# EAGLE design chv (EAGLE 7.6.0)
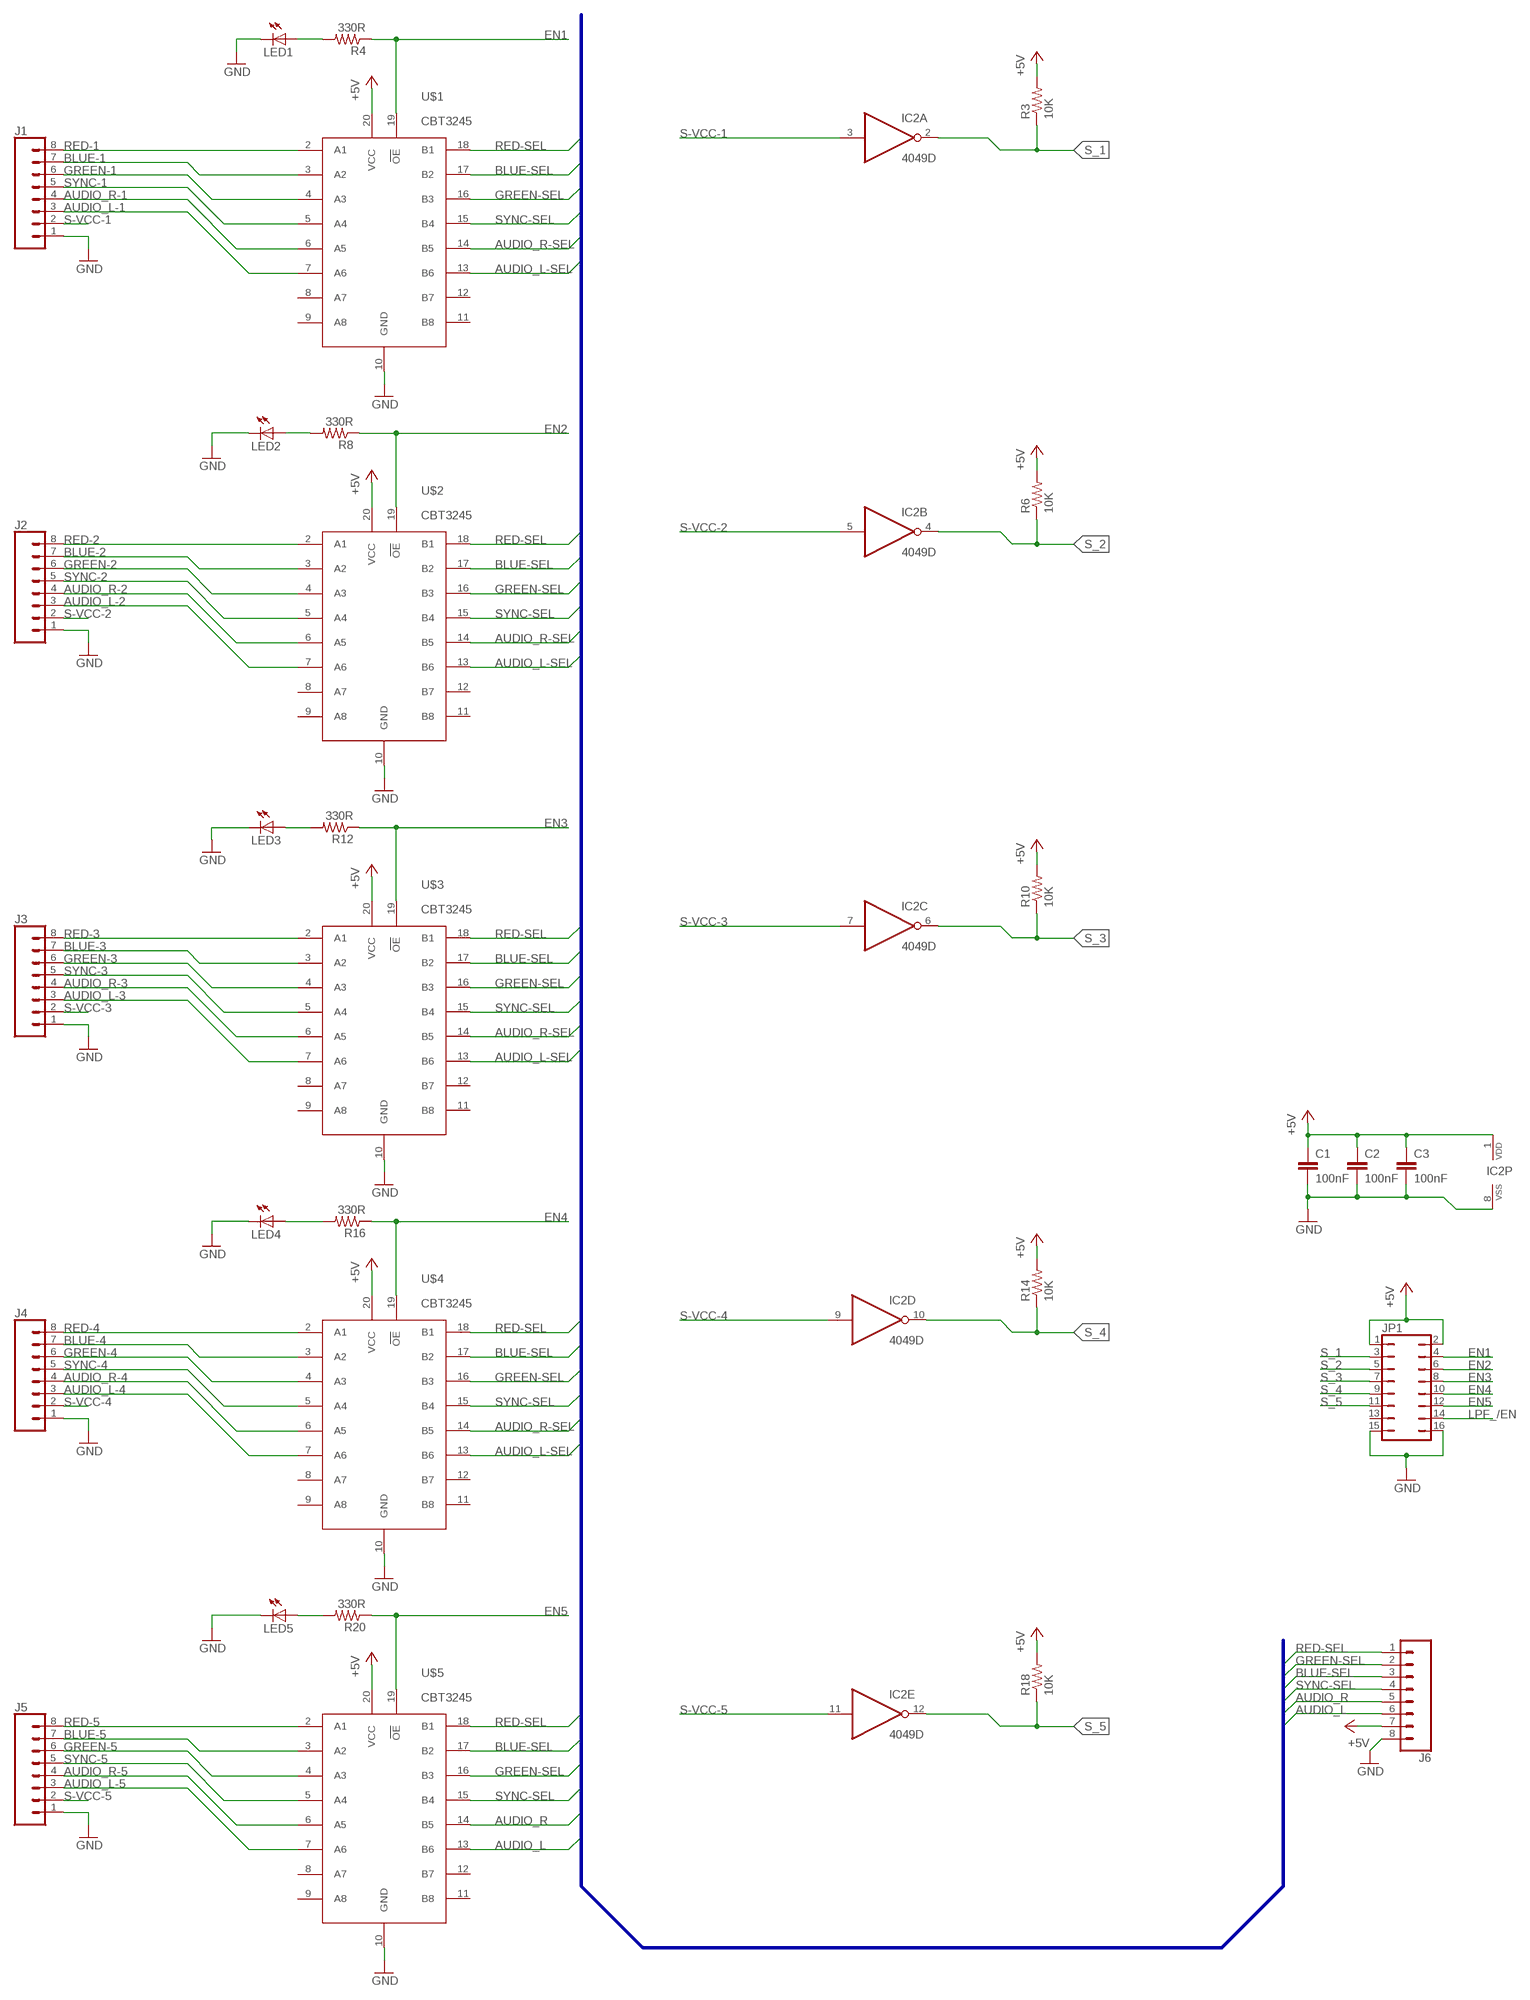
[diagram p0: schematic, sheet 1]

## Parts
C1  100nF  C-EU075-032X103  [C075-032X103]
C2  100nF  C-EU075-032X103  [C075-032X103]
C3  100nF  C-EU075-032X103  [C075-032X103]
IC2  4049D  [SO16]
J1  CONN_08LONGPADS  [1X08_LONGPADS]
J2  CONN_08LONGPADS  [1X08_LONGPADS]
J3  CONN_08LONGPADS  [1X08_LONGPADS]
J4  CONN_08LONGPADS  [1X08_LONGPADS]
J5  CONN_08LONGPADS  [1X08_LONGPADS]
J6  CONN_08LONGPADS  [1X08_LONGPADS]
JP1  JP8Q  [JP8Q]
LED1  LED5MM  [LED5MM]
LED2  LED5MM  [LED5MM]
LED3  LED5MM  [LED5MM]
LED4  LED5MM  [LED5MM]
LED5  LED5MM  [LED5MM]
R3  10K  R-US_0204/2V  [0204V]
R4  330R  R-US_0204/2V  [0204V]
R6  10K  R-US_0204/2V  [0204V]
R8  330R  R-US_0204/2V  [0204V]
R10  10K  R-US_0204/2V  [0204V]
R12  330R  R-US_0204/2V  [0204V]
R14  10K  R-US_0204/2V  [0204V]
R16  330R  R-US_0204/2V  [0204V]
R18  10K  R-US_0204/2V  [0204V]
R20  330R  R-US_0204/2V  [0204V]
U$1  CBT3245  [SO20]
U$2  CBT3245  [SO20]
U$3  CBT3245  [SO20]
U$4  CBT3245  [SO20]
U$5  CBT3245  [SO20]

## Nets
+5V: C1.1 C2.1 C3.1 IC2.1(P:VDD) J6.7 JP1.1 JP1.2 R3.2 R6.2 R10.2 R14.2 R18.2 U$1.20(VCC) U$2.20(VCC) U$3.20(VCC) U$4.20(VCC) U$5.20(VCC)
AUDIO_L: J6.6 U$5.13(B6)
AUDIO_L-1: J1.3 U$1.7(A6)
AUDIO_L-2: J2.3 U$2.7(A6)
AUDIO_L-3: J3.3 U$3.7(A6)
AUDIO_L-4: J4.3 U$4.7(A6)
AUDIO_L-5: J5.3 U$5.7(A6)
AUDIO_L-SEL: U$1.13(B6) U$2.13(B6) U$3.13(B6) U$4.13(B6)
AUDIO_R: J6.5 U$5.14(B5)
AUDIO_R-1: J1.4 U$1.6(A5)
AUDIO_R-2: J2.4 U$2.6(A5)
AUDIO_R-3: J3.4 U$3.6(A5)
AUDIO_R-4: J4.4 U$4.6(A5)
AUDIO_R-5: J5.4 U$5.6(A5)
AUDIO_R-SEL: U$1.14(B5) U$2.14(B5) U$3.14(B5) U$4.14(B5)
BLUE-1: J1.7 U$1.3(A2)
BLUE-2: J2.7 U$2.3(A2)
BLUE-3: J3.7 U$3.3(A2)
BLUE-4: J4.7 U$4.3(A2)
BLUE-5: J5.7 U$5.3(A2)
BLUE-SEL: J6.3 U$1.17(B2) U$2.17(B2) U$3.17(B2) U$4.17(B2) U$5.17(B2)
EN1: JP1.4 R4.1 U$1.19(OE)
EN2: JP1.6 R8.1 U$2.19(OE)
EN3: JP1.8 R12.1 U$3.19(OE)
EN4: JP1.10 R16.1 U$4.19(OE)
EN5: JP1.12 R20.1 U$5.19(OE)
GND: C1.2 C2.2 C3.2 IC2.8(P:VSS) J1.1 J2.1 J3.1 J4.1 J5.1 J6.8 JP1.15 JP1.16 LED1.K(C) LED2.K(C) LED3.K(C) LED4.K(C) LED5.K(C) U$1.10(GND) U$2.10(GND) U$3.10(GND) U$4.10(GND) U$5.10(GND)
GREEN-1: J1.6 U$1.4(A3)
GREEN-2: J2.6 U$2.4(A3)
GREEN-3: J3.6 U$3.4(A3)
GREEN-4: J4.6 U$4.4(A3)
GREEN-5: J5.6 U$5.4(A3)
GREEN-SEL: J6.2 U$1.16(B3) U$2.16(B3) U$3.16(B3) U$4.16(B3) U$5.16(B3)
LPF_/EN: JP1.14
N$1: LED1.A R4.2
N$2: LED2.A R8.2
N$5: LED3.A R12.2
N$6: LED4.A R16.2
N$7: LED5.A R20.2
RED-1: J1.8 U$1.2(A1)
RED-2: J2.8 U$2.2(A1)
RED-3: J3.8 U$3.2(A1)
RED-4: J4.8 U$4.2(A1)
RED-5: J5.8 U$5.2(A1)
RED-SEL: J6.1 U$1.18(B1) U$2.18(B1) U$3.18(B1) U$4.18(B1) U$5.18(B1)
S-VCC-1: IC2.3(A:I) J1.2
S-VCC-2: IC2.5(B:I) J2.2
S-VCC-3: IC2.7(C:I) J3.2
S-VCC-4: IC2.9(D:I) J4.2
S-VCC-5: IC2.11(E:I) J5.2
S_1: IC2.2(A:O) JP1.3 R3.1
S_2: IC2.4(B:O) JP1.5 R6.1
S_3: IC2.6(C:O) JP1.7 R10.1
S_4: IC2.10(D:O) JP1.9 R14.1
S_5: IC2.12(E:O) JP1.11 R18.1
SYNC-1: J1.5 U$1.5(A4)
SYNC-2: J2.5 U$2.5(A4)
SYNC-3: J3.5 U$3.5(A4)
SYNC-4: J4.5 U$4.5(A4)
SYNC-5: J5.5 U$5.5(A4)
SYNC-SEL: J6.4 U$1.15(B4) U$2.15(B4) U$3.15(B4) U$4.15(B4) U$5.15(B4)
Unconnected: IC2.14(F:I) IC2.15(F:O) JP1.13 U$1.8(A7) U$1.9(A8) U$1.11(B8) U$1.12(B7) U$2.8(A7) U$2.9(A8) U$2.11(B8) U$2.12(B7) U$3.8(A7) U$3.9(A8) U$3.11(B8) U$3.12(B7) U$4.8(A7) U$4.9(A8) U$4.11(B8) U$4.12(B7) U$5.8(A7) U$5.9(A8) U$5.11(B8) U$5.12(B7)

## Buses
B$1

## Library data of the parts
C1-C3 = rcl:C-EU: CAPACITOR, European symbol
IC2 = 40xx:4049: Hex inverting BUFFER
J1-J6 = SparkFun-Connectors:CONN_08: Multi connection point. Often used as Generic Header-pin footprint for 0.1 inch spaced/style header connections On any of the 0.1 inch spaced packages, you can populate with these: Break Away Headers - Straight <https://www.sparkfun.com/products/116> (PRT-00116) Break Away Male Headers - Right Angle <https://www.sparkfun.com/products/553> (PRT-00553) Female Headers <https://www.sparkfun.com/products/115> (PRT-00115) Break Away Headers - Machine Pin <https://www.sparkfun.com/products/117> (PRT-00117) Break Away Female Headers - Swiss Machine Pin <https://www.sparkfun.com/products/743> (PRT-00743) Arduino Stackable Header - 8 Pin <https://www.sparkfun.com/products/9279> (PRT-09279) For SCREWTERMINALS and SPRING TERMINALS visit here: Screw Terimnals on SparkFun.com <https://www.sparkfun.com/search/results?term=Screw+Terminals> (5mm/3.5mm/2.54mm spacing) This device is also useful as a general connection point to wire up your design to another part of your project. Our various solder wires solder well into these plated through hole pads. Hook-Up Wire - Assortment (Stranded, 22 AWG) <https://www.sparkfun.com/products/11375> (PRT-11375) Hook-Up Wire - Assortment (Solid Core, 22 AWG) <https://www.sparkfun.com/products/11367> (PRT-11367) View the entire wire category on our website here <https://www.sparkfun.com/categories/141> Special notes: Molex polarized connector foot print use with SKU : PRT-08231 with associated crimp pins and housings. 1MM SMD Version SKU: PRT-10208 NOTES ON THE VARIANTS LOCK and LOCK_LONGPADS... This footprint was designed to help hold the alignment of a through-hole component (i.e. 6-pin header) while soldering it into place. You may notice that each hole has been shifted either up or down by 0.005 of an inch from it's more standard position (which is a perfectly straight line). This slight alteration caused the pins (the squares in the middle) to touch the edges of the holes. Because they are alternating, it causes a "brace" to hold the component in place. 0.005 has proven to be the perfect amount of "off-center" position when using our standard breakaway headers. Although looks a little odd when you look at the bare footprint, once you have a header in there, the alteration is very hard to notice. Also,if you push a header all the way into place, it is covered up entirely on the bottom side.
JP1 = jumper:JP8Q: JUMPER
LED1-LED5 = led:LED: LED OSRAM: - CHIPLED LG R971, LG N971, LY N971, LG Q971, LY Q971, LO R971, LY R971 LH N974, LH R974 LS Q976, LO Q976, LY Q976 LO Q996 - Hyper CHIPLED LW Q18S LB Q993, LB Q99A, LB R99A - SideLED LS A670, LO A670, LY A670, LG A670, LP A670 LB A673, LV A673, LT A673, LW A673 LH A674 LY A675 LS A676, LA A676, LO A676, LY A676, LW A676 LS A679, LY A679, LG A679 - Hyper Micro SIDELED® LS Y876, LA Y876, LO Y876, LY Y876 LT Y87S - SmartLED LW L88C, LW L88S LB L89C, LB L89S, LG L890 LS L89K, LO L89K, LY L89K LS L896, LA L896, LO L896, LY L896 - TOPLED LS T670, LO T670, LY T670, LG T670, LP T670 LSG T670, LSP T670, LSY T670, LOP T670, LYG T670 LG T671, LOG T671, LSG T671 LB T673, LV T673, LT T673, LW T673 LH T674 LS T676, LA T676, LO T676, LY T676, LB T676, LH T676, LSB T676, LW T676 LB T67C, LV T67C, LT T67C, LS T67K, LO T67K, LY T67K, LW E67C LS E67B, LA E67B, LO E67B, LY E67B, LB E67C, LV E67C, LT E67C LW T67C LS T679, LY T679, LG T679 LS T770, LO T770, LY T770, LG T770, LP T770 LB T773, LV T773, LT T773, LW T773 LH T774 LS E675, LA E675, LY E675, LS T675 LS T776, LA T776, LO T776, LY T776, LB T776 LHGB T686 LT T68C, LB T68C - Hyper Mini TOPLED® LB M676 - Mini TOPLED Santana® LG M470 LS M47K, LO M47K, LY M47K Source: http://www.osram.convergy.de LUXEON: - LUMILED® LXK2-PW12-R00, LXK2-PW12-S00, LXK2-PW14-U00, LXK2-PW14-V00 LXK2-PM12-R00, LXK2-PM12-S00, LXK2-PM14-U00 LXK2-PE12-Q00, LXK2-PE12-R00, LXK2-PE12-S00, LXK2-PE14-T00, LXK2-PE14-U00 LXK2-PB12-K00, LXK2-PB12-L00, LXK2-PB12-M00, LXK2-PB14-N00, LXK2-PB14-P00, LXK2-PB14-Q00 LXK2-PR12-L00, LXK2-PR12-M00, LXK2-PR14-Q00, LXK2-PR14-R00 LXK2-PD12-Q00, LXK2-PD12-R00, LXK2-PD12-S00 LXK2-PH12-R00, LXK2-PH12-S00 LXK2-PL12-P00, LXK2-PL12-Q00, LXK2-PL12-R00 Source: www.luxeon.com KINGBRIGHT: KA-3528ASYC Source: www.kingbright.com
R3 R4 R6 R8 R10 R12 R14 R16 R18 R20 = rcl:R-US_: RESISTOR, American symbol
U$1-U$5 = CBT3245:CBT3245

## Net classes
0 default: width 0.406 mm
1 AMP: width 0.381 mm
2 POWER: width 0.5 mm

## Board
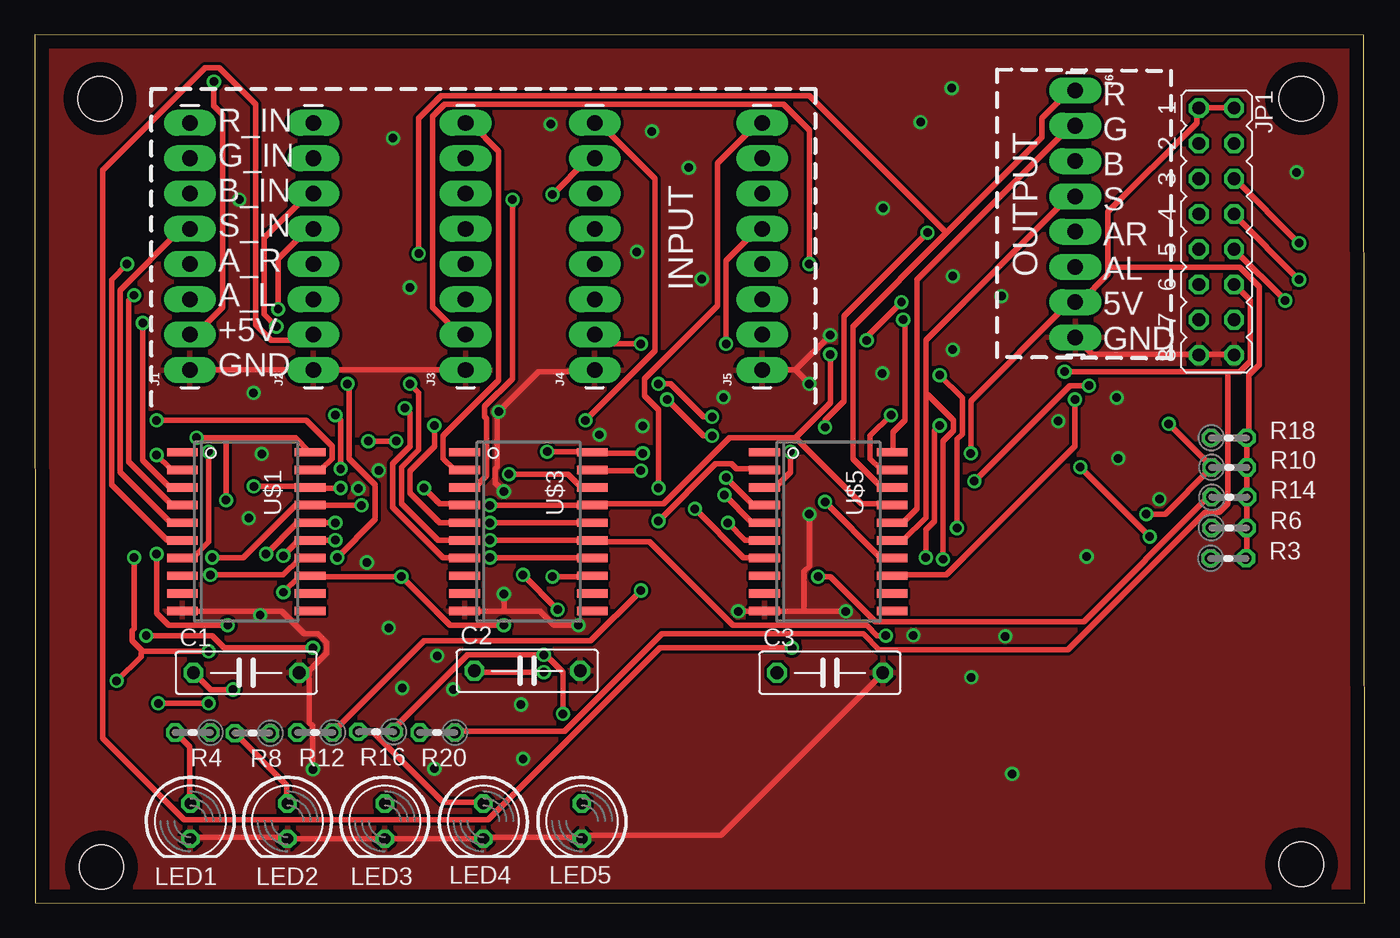
[diagram p1: board, top side]
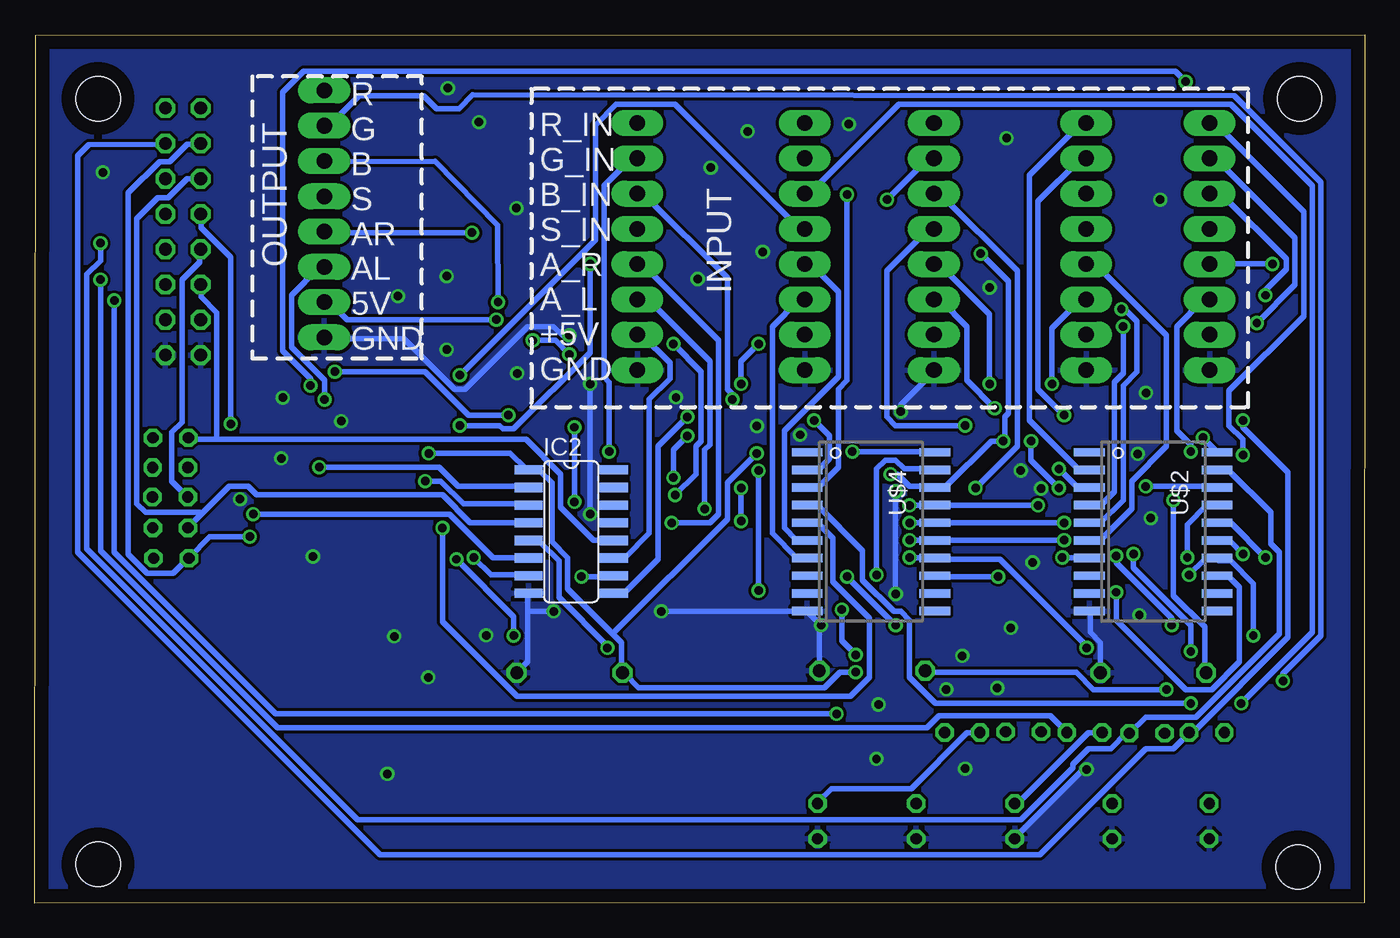
[diagram p2: board, bottom side, seen from below]

Size 95.76 x 62.5 mm. Coordinates in mm from the lower left corner, seen from the top.
Outline: 0.04,0.03 95.76,0 95.69,62.48 0,62.5 0.04,0.03
Copper layers (1*16): Top 0.035mm / dielectric 1.5mm / Bottom 0.035mm
Design rules "default": minimum track width 10mil, minimum drill 24mil, track to track 8mil, track to pad 8mil, pad to pad 8mil, via to via 8mil, smd to smd 8mil, copper to edge 40mil, drill to drill 8mil, minimum pad ring 10mil, minimum via ring 8mil, stop-mask expansion 4mil, vias tented up to drill 0mil, thermal gap 10mil
Holes 3.2 mm at 4.7,57.9 4.8,2.6 91.2,2.8 91.2,57.9

### Footprints (pad centres in the part's own frame; a part is rotated, then mirrored left to right if it is on the bottom)
C075-032X103 = drill 0.914 octagon: 1 -3.81,0; 2 3.81,0
SO16 = smd 0.66 x 2.032: 1 -4.445,-3.073; 2 -3.175,-3.073; 3 -1.905,-3.073; 4 -0.635,-3.073; 5 0.635,-3.073; 6 1.905,-3.073; 7 3.175,-3.073; 8 4.445,-3.073; 9 4.445,3.073; 10 3.175,3.073; 11 1.905,3.073; 12 0.635,3.073; 13 -0.635,3.073; 14 -1.905,3.073; 15 -3.175,3.073; 16 -4.445,3.073
1X08_LONGPADS = drill 1.118 pad 1.88 long: 1 0,0; 2 2.54,0; 3 5.08,0; 4 7.62,0; 5 10.16,0; 6 12.7,0; 7 15.24,0; 8 17.78,0
JP8Q = drill 0.914 octagon: 1 -8.89,-1.27; 2 -8.89,1.27; 3 -6.35,-1.27; 4 -6.35,1.27; 5 -3.81,-1.27; 6 -3.81,1.27; 7 -1.27,-1.27; 8 -1.27,1.27; 9 1.27,-1.27; 10 1.27,1.27; 11 3.81,-1.27; 12 3.81,1.27; 13 6.35,-1.27; 14 6.35,1.27; 15 8.89,-1.27; 16 8.89,1.27
LED5MM = drill 0.813 octagon: A -1.27,0; K 1.27,0
0204V = drill 0.813 octagon: 1 -1.27,0; 2 1.27,0
SO20 = smd 0.6 x 2.2: 1 -5.715,-4.6; 2 -4.445,-4.6; 3 -3.175,-4.6; 4 -1.905,-4.6; 5 -0.635,-4.6; 6 0.635,-4.6; 7 1.905,-4.6; 8 3.175,-4.6; 9 4.445,-4.6; 10 5.715,-4.6; 11 5.715,4.6; 12 4.445,4.6; 13 3.175,4.6; 14 1.905,4.6; 15 0.635,4.6; 16 -0.635,4.6; 17 -1.905,4.6; 18 -3.175,4.6; 19 -4.445,4.6; 20 -5.715,4.6

### Placement (x,y rotation side)
C1  15.23,16.58 0 top
C2  35.46,16.72 0 top
C3  57.25,16.58 0 top
IC2  57.14,26.74 270 bottom
J1  11.17,38.37 90 top
J2  20.06,38.37 90 top
J3  31.02,38.37 90 top
J4  40.31,38.37 90 top
J5  52.37,38.37 90 top
J6  74.92,58.49 270 top
JP1  85.08,48.33 270 top
LED1  11.2,5.9 270 top
LED2  18.2,5.9 270 top
LED3  25.2,5.9 270 top
LED4  32.3,5.9 270 top
LED5  39.4,5.9 270 top
R3  85.93,24.82 0 top
R4  11.38,12.28 180 top
R6  85.99,27.01 0 top
R8  15.68,12.23 180 top
R10  86,31.36 0 top
R12  20.18,12.28 180 top
R14  86.01,29.22 0 top
R16  24.58,12.33 180 top
R18  85.97,33.49 0 top
R20  28.98,12.28 180 top
U$1  15.23,26.74 270 top
U$2  15.23,26.74 270 bottom
U$3  35.55,26.74 270 top
U$4  35.55,26.74 270 bottom
U$5  57.14,26.74 270 top

### Tracks (layer width: path | path; a pad name or v marks a point on that pad's centre or on a via)
+5V  (via drill 0.61)
  Top 0.406: R3.2 87.28,24.88 87.28,27 R6.2 87.28,27.12 87.28,29.12 R14.2 87.28,29.25 87.28,31.25 R10.2 87.28,31.38 87.28,33.38 R18.2 87.4,33.62 87.4,38 88.15,38.75 88.15,44.38 86.78,45.75 77.28,45.75 | JP1.2 86.28,57.25 83.9,57.25 JP1.1 83.65,57.12 83.65,56.12 77.28,49.75 77.28,45.75 | v62.52,42 62.65,41.88 62.65,34.75 61.77,33.88 61.77,32.5 U$5.20 | 77.28,45.75 77.28,45.25 75.28,43.25 J6.7 74.78,43.12 74.4,43.12 67.4,36.12 v67.4,32.38 | 13.78,33.5 18.77,33.5 19.77,32.5 U$1.20 | 13.78,33.5 v11.65,33.5 | 13.78,33.5 v13.78,29 | v14.28,15.38 12.65,15.38 11.53,16.5 C1.1 | v36.9,32.5 40.15,32.5 U$3.20 40.27,32.38 v43.77,32.38 | v36.65,16.62 31.65,16.62 C2.1
  Bottom 0.406: v62.52,42 73.28,42 74.53,43.25 J6.7 | v11.65,33.5 10.65,32.5 U$2.20 | v13.78,29 13.78,22.12 11.53,19.88 11.53,16.62 C1.1 | v14.28,15.38 19.52,15.38 20.77,16.62 31.65,16.62 C2.1 | v36.9,32.5 31.02,32.5 U$4.20 | 54.15,19.38 53.52,18.75 53.52,16.62 C3.1 53.27,16.5 52.27,15.5 38.9,15.5 37.77,16.62 v36.65,16.62 | 54.15,19.38 57.4,22.62 57.4,24.88 58.52,26 58.52,30.25 59.4,31.12 60.15,31.12 IC2.1 60.4,31.25 61.52,32.38 v67.4,32.38 | v43.77,32.38 45.9,30.25 45.9,27.62 54.15,19.38
AUDIO_L  (via drill 0.61)
  Top 0.406: v74.9,36.25 74.9,32.88 65.65,23.62 61.77,23.62 U$5.13
  Bottom 0.406: v74.9,36.25 74.9,37.62 77.28,40 77.28,43.75 75.28,45.75 75.03,45.75 J6.6
AUDIO_L-1  (via drill 0.61)
  Top 0.406: v12.53,32.5 12.53,26 11.4,24.88 10.65,24.88 U$1.7
  Bottom 0.406: v12.53,32.5 12.53,33 13.53,34 13.53,41.5 11.65,43.38 11.28,43.38 J1.3
AUDIO_L-2  (via drill 0.61)
  Top 0.406: v21.77,24.88 24.52,27.62 24.51,30.09 22.64,31.97 22.65,37.25 v22.52,37.38
  Bottom 0.406: v21.77,24.88 19.9,24.88 U$2.7 | v22.52,37.38 22.52,41.38 20.52,43.38 20.15,43.38 J2.3
AUDIO_L-3  (via drill 0.61)
  Top 0.406: v26.65,35.62 27.02,35.25 27.02,32.88 25.77,31.62 25.77,28.5 29.4,24.88 30.9,24.88 U$3.7
  Bottom 0.406: v26.65,35.62 28.65,37.62 28.65,41.5 30.52,43.38 30.9,43.38 J3.3
AUDIO_L-4
  Bottom 0.406: U$4.7 40.15,24.88 40.9,24.88 42.65,26.62 42.65,41.5 40.77,43.38 40.4,43.38 J4.3
AUDIO_L-5  (via drill 0.61)
  Top 0.406: v47.52,28.38 51.02,24.88 52.52,24.88 U$5.7
  Bottom 0.406: v47.52,28.38 47.52,32.62 47.15,33 47.15,39 51.52,43.38 52.27,43.38 J5.3
AUDIO_L-SEL  (via drill 0.61)
  Top 0.406: v17.9,22.38 19.02,23.5 19.77,23.5 U$1.13 20.02,23.5 v26.4,23.5 29.9,20 v33.77,20 | v37.27,23.5 40.15,23.5 U$3.13
  Bottom 0.406: v17.9,22.38 17.9,20.38 12.9,15.38 11.03,15.38 9.03,17.38 9.03,22.75 9.78,23.5 10.53,23.5 U$2.13 | v26.4,23.5 30.9,23.5 U$4.13 | v33.77,20 v37.27,23.5
AUDIO_R  (via drill 0.61)
  Top 0.406: v56.9,28.88 60.9,24.88 61.65,24.88 U$5.14 | v56.9,34.25 56.9,34.75 58.27,36.12 58.27,42.25 v64.28,48.25
  Bottom 0.406: v56.9,34.25 v56.9,28.88 | v64.28,48.25 74.9,48.25 J6.5
AUDIO_R-1  (via drill 0.61)
  Top 0.406: v6.65,46 5.53,44.88 5.53,30.12 9.53,26.12 10.53,26.12 U$1.6
  Bottom 0.406: v6.65,46 11.15,46 J1.4
AUDIO_R-2
  Bottom 0.406: U$2.6 19.77,26.12 19.02,26.12 16.77,28.38 16.77,30.38 14.28,32.88 14.28,40.88 19.27,45.88 20.02,45.88 J2.4
AUDIO_R-3  (via drill 0.61)
  Top 0.406: v27.02,37.38 27.65,36.75 27.65,32.62 26.4,31.38 26.4,28.75 29.02,26.12 30.9,26.12 U$3.6
  Bottom 0.406: v27.02,37.38 27.02,42.38 30.52,45.88 30.9,45.88 J3.4
AUDIO_R-4
  Bottom 0.406: U$4.6 40.15,26.12 40.9,26.12 41.77,27 41.77,34 37.9,37.88 37.9,44 39.77,45.88 40.27,45.88 J4.4
AUDIO_R-5  (via drill 0.61)
  Top 0.406: v49.9,27.38 51.15,26.12 52.52,26.12 U$5.6
  Bottom 0.406: v49.9,27.38 47.15,27.38 46.52,28 46.52,40.5 51.9,45.88 52.27,45.88 J5.4
AUDIO_R-SEL  (via drill 0.61)
  Top 0.406: v32.77,24.88 40.15,24.88 U$3.14 | v12.65,23.62 17.9,23.62 19.02,24.75 19.77,24.75 U$1.14 | v20.02,18.38 13.65,18.38 12.78,19.25 v8.03,19.25
  Bottom 0.406: v32.77,24.88 31.02,24.88 U$4.14 30.77,24.75 26.27,24.75 20.02,18.5 v20.02,18.38 | v12.65,23.62 11.53,24.75 10.65,24.75 U$2.14 10.53,24.62 9.65,24.62 8.03,23 v8.03,19.25
BLUE-1  (via drill 0.61)
  Top 0.406: v7.78,41.75 7.78,31.88 9.65,30 10.53,30 U$1.3
  Bottom 0.406: v7.78,41.75 5.03,44.5 5.03,47.88 10.65,53.5 11.15,53.5 J1.7
BLUE-2  (via drill 0.61)
  Top 0.406: v22.02,31.25 22.02,34.75 v21.65,35.12
  Bottom 0.406: v22.02,31.25 20.77,30 19.9,30 U$2.3 | v21.65,35.12 23.52,37 23.52,50.5 20.52,53.5 20.15,53.5 J2.7
BLUE-3  (via drill 0.61)
  Top 0.406: v34.4,50.62 34.4,37.75 32.4,35.75 32.4,35 32.52,34.88 32.52,30.75 31.77,30 31.02,30 U$3.3
  Bottom 0.406: v34.4,50.62 31.52,53.5 31.02,53.5 J3.7
BLUE-4  (via drill 0.61)
  Top 0.406: v37.27,51 39.77,53.5 40.27,53.5 J4.7
  Bottom 0.406: v37.27,51 37.27,37.62 37.9,37 37.9,31.38 39.27,30 40.15,30 U$4.3
BLUE-5  (via drill 0.61)
  Top 0.406: v54.4,32.5 54.4,31 53.4,30 52.65,30 U$5.3
  Bottom 0.406: v54.4,32.5 54.4,37.5 54.77,37.88 54.77,51.62 52.9,53.5 52.4,53.5 J5.7
BLUE-SEL  (via drill 0.61)
  Top 0.406: v12.78,24.88 15.03,24.88 18.77,28.62 19.77,28.62 U$1.17 20.02,28.62 v23.52,28.62 | v32.77,28.62 40.15,28.62 U$3.17 40.27,28.75 45.27,28.75 50.02,33.5 54.77,33.5 | 54.77,33.5 59.52,28.75 61.65,28.75 U$5.17 | v62.4,43.25 59.9,40.75 v59.9,40.5 | v57.27,39.5 57.27,36 54.77,33.5
  Bottom 0.406: v12.78,24.88 12.78,27.25 11.4,28.62 10.65,28.62 U$2.17 | v32.77,28.62 31.02,28.62 U$4.17 30.77,28.62 v23.52,28.62 | v62.4,43.25 62.42,48.79 66.95,53.38 74.9,53.38 J6.3 | v59.9,40.5 58.27,40.5 v57.27,39.5
EN1  (via drill 0.61)
  Top 0.406: v8.78,34.75 19.52,34.75 21.4,32.88 21.4,32 20.65,31.25 19.9,31.25 U$1.19
  Bottom 0.406: v8.78,34.75 8.78,34.25 5.53,31 5.53,19.12 12.28,12.38 12.65,12.38 R4.1 12.78,12.12 13.78,11.12 15.78,11.12 23.4,3.5 70.9,3.5 92.65,25.25 92.68,53.63 92.68,53.79 91.87,54.6 86.4,54.62 JP1.4
EN2  (via drill 0.61)
  Top 0.406: v91.03,47.5 86.4,52.12 JP1.6
  Bottom 0.406: U$2.19 10.53,31.12 9.78,31.12 6.78,28.12 6.78,25.88 6.15,25.25 6.15,19.38 12.15,13.38 15.78,13.38 16.9,12.25 R8.1 17.15,12.25 18.27,11.12 19.9,11.12 21.02,10 21.02,9.75 24.77,6 72.53,6 92.03,25.5 92.03,45.25 91.03,46.25 v91.03,47.5
EN3  (via drill 0.61)
  Top 0.406: v43.65,31.12 40.15,31.12 U$3.19 | v43.65,22.5 40.02,18.88 28.02,18.88 21.52,12.38 R12.1 | v91.03,44.88 86.4,49.5 JP1.8
  Bottom 0.406: v43.65,22.5 v43.65,31.12 | v91.03,44.88 91.03,25.38 78.28,12.62 31.52,12.62 30.65,13.5 22.65,13.5 21.52,12.38 R12.1
EN4  (via drill 0.61)
  Top 0.406: v37.65,21.12 v35.15,23.62 | R16.1 25.9,12.38 25.9,12.62 31.15,17.88 v36.65,17.88 36.77,17.88 38.02,16.62 v38.02,13.62 | v90.03,43.38 86.4,47 JP1.10
  Bottom 0.406: v35.15,23.62 35.15,31.25 34.52,31.88 33.77,31.88 33.15,31.25 31.02,31.25 U$4.19 | v37.65,21.12 37.65,18.88 v36.65,17.88 | v90.03,43.38 90.03,25.25 78.4,13.62 v38.02,13.62
EN5  (via drill 0.61)
  Top 0.406: v61.65,35.12 60.15,33.62 60.15,32 60.9,31.25 61.65,31.25 U$5.19 | 85.9,38.25 86.78,38.25 87.53,39 87.53,43.38 86.4,44.5 JP1.12 | 85.9,38.25 v74.15,38.25 | 85.9,38.25 85.9,28.75 85.28,28.12 84.28,28.12 74.4,18.25 60.77,18.25 59.65,19.38 45.15,19.38 38.15,12.38 30.27,12.38 R20.1
  Bottom 0.406: v61.65,35.12 64.53,35.12 67.65,38.25 v74.15,38.25
GND  (via drill 0.61)
  Top 0.406: 19.65,16.62 21.02,18 21.02,18.75 20.4,19.38 19.4,19.38 17.77,21 10.65,21 U$1.10 | 19.65,16.62 19.15,16.62 C1.2 | LED1.K 11.28,4.75 18.15,4.75 LED2.K 18.4,4.62 25.15,4.62 LED3.K 25.4,4.62 32.27,4.62 LED4.K 32.4,4.75 39.4,4.75 LED5.K 39.52,4.88 49.4,4.88 61.02,16.5 C3.2 | v20.02,9.62 20.02,12.75 19.77,13 19.77,16.5 19.65,16.62 | JP1.16 86.28,39.5 83.9,39.5 JP1.15 83.65,39.5 76.15,39.5 75.03,40.62 J6.8 | 54.77,38.38 52.4,38.38 J5.1 | v57.27,40.88 54.77,38.38 | J1.1 11.28,38.38 20.02,38.38 J2.1 20.15,38.38 30.9,38.38 J3.1 | J4.1 40.27,38.25 36.27,38.25 v33.4,35.38 33.27,35.25 33.27,31.38 33.15,31.25 33.15,30.25 v33.77,29.62 | 33.77,21 36.4,21 37.4,20 v39.15,20 | 33.77,21 31.02,21 U$3.10 | v58.4,21 55.4,21 | 55.4,21 52.65,21 U$5.10 52.4,21 v50.65,21 | 33.77,21 v33.77,22.25 | v55.77,37.38 54.77,38.38 | v55.77,28 55.77,24.25 55.4,23.88 55.4,21
  Bottom 0.406: U$2.10 19.77,21 19.77,19.5 19.02,18.75 19.02,16.62 C1.2 | v20.02,9.62 20.27,9.62 25.15,4.75 LED3.K | v57.27,40.88 57.77,40.88 58.4,41.5 60.27,41.5 64.78,37 65.53,37 69.15,40.62 74.9,40.62 J6.8 | v33.4,35.38 33.4,35.88 31.02,38.25 J3.1 | C2.2 39.27,16.75 39.27,19.88 v39.15,20 40.15,21 U$4.10 40.27,21 v50.65,21 | 60.27,21 60.27,17.38 61.02,16.62 C3.2 | 60.27,21 60.27,22.25 IC2.8 | 60.27,21 v58.4,21 | v33.77,22.25 v33.77,29.62 | v55.77,28 v55.77,37.38
  other vias: 37.15,56.07 14.73,50.63 16.23,20.73 26.46,15.48 30.13,15.39 28.98,17.8 35.16,10.39 28.77,9.68 35.01,14.3 23.91,24.52 25.48,19.81 15.76,36.73 16.35,32.34 15.41,27.71 24.77,31.14 23.3,29.84 25.79,55.06 44.44,55.54 47.09,52.93 48.02,44.92 43.35,46.87 66.1,45.12 69.6,43.69 66.1,39.83 61.02,38.13 66.02,58.66 63.77,56.21 61.07,50.02 90.86,52.59 70.37,9.3 75.73,24.95 77.9,36.38 78.01,32.01 63.26,19.27 69.88,19.2 67.43,16.25 73.69,34.69 80.97,29.08 49.59,36.4 43.77,34.34 40.66,33.71 27.01,44.31
  pour Top: -0.07,62.56 95.64,62.56 95.69,-0.06 -0.02,-0.06
  pour Bottom: -0.05,62.55 95.64,62.55 95.64,-0.12 -0.05,-0.12
GREEN-1  (via drill 0.61)
  Top 0.406: v7.15,43.75 6.78,43.38 6.78,31.75 9.78,28.75 10.53,28.75 U$1.4
  Bottom 0.406: v7.15,43.75 7.15,44.12 5.65,45.62 5.65,46.38 10.28,51 11.15,51 J1.6
GREEN-2  (via drill 0.61)
  Top 0.406: v17.4,41.5 16.52,42.38 16.52,47.88 19.65,51 20.02,51 J2.6
  Bottom 0.406: v17.4,41.5 17.4,38.12 18.02,37.5 18.02,29.62 18.9,28.75 19.77,28.75 U$2.4
GREEN-3  (via drill 0.61)
  Top 0.406: v28.02,29.88 29.15,28.75 30.9,28.75 U$3.4
  Bottom 0.406: v28.02,29.88 25.02,32.88 25.02,45.5 30.52,51 30.9,51 J3.6
GREEN-4  (via drill 0.61)
  Top 0.406: v8.9,14.38 v12.53,14.38
  Bottom 0.406: v12.53,14.38 30.9,14.38 32.77,16.25 32.77,20.38 33.4,21 33.9,21 36.15,23.25 36.15,25.38 39.4,28.62 40.15,28.62 U$4.4 | v8.9,14.38 3.77,19.5 3.77,51.62 9.65,57.5 33.52,57.5 39.9,51.12 40.27,51.12 J4.6
GREEN-5  (via drill 0.61)
  Top 0.406: v49.77,30.62 51.65,28.75 52.52,28.75 U$5.4 | v48.77,33.62 48.15,33.62 v45.52,36.25
  Bottom 0.406: v49.77,30.62 49.77,32.62 v48.77,33.62 | v45.52,36.25 45.52,36.62 45.9,37 45.9,45 51.9,51 52.27,51 J5.6
GREEN-SEL  (via drill 0.61)
  Top 0.406: U$3.16 v32.77,27.38 | v7.15,24.88 7.15,19.75 7.03,19.62 7.03,18.88 7.78,18.12 | v12.53,18.12 7.78,18.12 | v16.65,25.12 18.9,27.38 U$1.16 v21.65,27.38 | U$5.16 62.52,27.38 63.52,28.38 63.52,44.88 74.53,55.88 74.9,55.88 J6.2 | v5.9,16 7.65,17.75 7.65,18 7.78,18.12
  Bottom 0.406: v32.77,27.38 U$4.16 v21.65,27.38 | U$2.16 9.65,27.38 v7.15,24.88 | v12.53,18.12 12.53,20 16.65,24.12 v16.65,25.12 | v5.9,16 5.9,16.5 3.15,19.25 3.15,51.88 9.4,58.12 64.23,58.18 65.22,57.19 66.81,57.19 67.75,58.12 72.4,58.12 74.53,56 74.9,56 J6.2
N$1
  Top 0.406: LED1.A 11.15,7.25 11.15,11.25 10.15,12.25 R4.2
N$2
  Top 0.406: LED2.A 18.15,7.25 18.15,8.5 14.53,12.12 R8.2
N$5
  Bottom 0.406: R12.2 19.02,12.25 19.9,12.25 24.9,7.25 25.15,7.25 LED3.A
N$6
  Top 0.406: R16.2 23.4,12.25 24.4,12.25 29.4,7.25 32.27,7.25 LED4.A
N$7
  Bottom 0.406: R20.2 27.77,12.25 28.65,12.25 32.65,8.25 38.4,8.25 39.4,7.25 LED5.A
RED-1  (via drill 0.61)
  Top 0.406: v8.78,32.25 9.78,31.25 10.53,31.25 U$1.2
  Bottom 0.406: v8.78,32.25 8.78,33.38 9.78,34.38 9.78,36.88 4.4,42.25 4.4,49.75 10.78,56.12 11.15,56.12 J1.8
RED-2
  Bottom 0.406: U$2.2 19.9,31.25 20.65,31.25 24.15,34.75 24.15,52.38 20.4,56.12 20.15,56.12 J2.8
RED-3
  Top 0.406: U$3.2 30.9,31.25 30.15,31.25 29.4,32 29.4,33.62 33.4,37.62 33.4,54.12 31.4,56.12 31.02,56.12 J3.8
RED-4  (via drill 0.61)
  Top 0.406: v39.65,34.75 44.65,39.75 44.65,52.12 40.65,56.12 40.4,56.12 J4.8
  Bottom 0.406: v39.65,34.75 38.52,33.62 38.52,32 39.27,31.25 40.15,31.25 U$4.2
RED-5  (via drill 0.61)
  Top 0.406: v44.9,27.5 49.02,31.62 50.15,31.62 50.52,31.25 52.52,31.25 U$5.2 | v44.9,29.88 44.9,35.5 43.9,36.5 43.9,37.75 49.15,43 49.15,53.25 52.02,56.12 52.27,56.12 J5.8
  Bottom 0.406: v44.9,29.88 v44.9,27.5
RED-SEL  (via drill 0.61)
  Top 0.406: v15.78,30 19.77,30 U$1.18 20.02,29.88 v22.02,29.88 | v34.15,30.88 38.4,30.88 39.27,30 40.15,30 U$3.18 | v26.02,33.25 v24.02,33.25 | 65.65,48.25 72.53,55.12 72.53,56.5 74.4,58.38 74.9,58.38 J6.1 | 65.65,48.25 58.9,41.5 58.9,32 60.9,30 61.65,30 U$5.18 | v27.65,46.75 27.65,56.5 29.27,58.12 55.77,58.12 65.65,48.25
  Bottom 0.406: v15.78,30 10.65,30 U$2.18 | v34.15,30.88 33.65,30.88 32.77,30 31.02,30 U$4.18 30.77,30 30.15,30 26.9,33.25 v26.02,33.25 25.9,33.38 25.9,35 25.65,35.25 25.65,44.75 v27.65,46.75 | v22.02,29.88 24.02,31.88 v24.02,33.25
S-VCC-1  (via drill 0.61)
  Top 0.406: v67.65,30.38 74.53,37.25 v75.9,37.25 | v12.9,59.12 12.9,57.38 13.53,56.75 13.53,42.88 11.65,41 11.28,41 J1.2
  Bottom 0.406: v67.65,30.38 66.53,30.38 64.9,28.75 60.27,28.75 IC2.3 | v75.9,37.25 75.9,37.75 77.9,39.75 77.9,58.38 76.4,59.88 13.65,59.88 v12.9,59.12
S-VCC-2  (via drill 0.61)
  Top 0.406: v54.52,18.38 45.02,18.38 32.65,6 10.78,6 4.9,11.88 4.9,52.75 12.28,60.12 13.28,60.12 15.9,57.5 15.9,41.62 17.02,40.5 19.65,40.5 J2.2
  Bottom 0.406: v54.52,18.38 54.52,18.5 58.02,22 58.02,24.62 59.4,26 60.15,26 IC2.5
S-VCC-3  (via drill 0.61)
  Top 0.406: v64.15,24.88 64.15,26.88 64.78,27.5 64.78,34 v65.15,34.38 | v55.77,46 55.77,55.62 53.9,57.5 29.52,57.5 28.65,56.62 28.65,42.88 30.52,41 30.9,41 J3.2
  Bottom 0.406: v64.15,24.88 62.9,23.62 60.27,23.62 IC2.7 | v65.15,34.38 62.27,34.38 62.02,34.12 61.27,34.12 55.77,39.62 v55.77,46
S-VCC-4  (via drill 0.61)
  Top 0.406: v48.77,35 48.15,35 45.77,37.38 v44.9,37.38 | v43.65,40.25 41.02,40.25 40.4,40.88 J4.2
  Bottom 0.406: v48.77,35 50.9,32.88 50.9,24.75 53.27,22.38 54.02,22.38 IC2.9 | v44.9,37.38 44.9,39 v43.65,40.25
S-VCC-5
  Bottom 0.406: IC2.11 54.02,24.88 53.27,24.88 51.52,26.62 51.52,36.25 50.02,37.75 50.02,38.88 52.02,40.88 52.27,40.88 J5.2
S_1  (via drill 0.61)
  Top 0.406: v80.28,26.38 v75.28,31.38
  Bottom 0.406: v75.28,31.38 66.65,31.38 65.28,30 60.27,30 IC2.2 | v80.28,26.38 83.15,26.38 84.65,24.88 R3.1 84.78,24.75 85.78,23.75 87.65,23.75 89.03,25.12 89.03,51.12 86.78,53.38 86.03,53.38 84.78,54.62 83.9,54.62 JP1.3
S_2
  Bottom 0.406: IC2.4 64.4,27.38 66.4,29.38 79.78,29.38 80.4,30 81.78,30 83.78,28 | 83.78,28 84.65,27.12 R6.1 | JP1.5 83.9,52.12 84.78,52.12 86.15,50.75 86.9,50.75 88.4,49.25 88.4,28.75 87.78,28.12 83.9,28.12 83.78,28
S_3  (via drill 0.61)
  Top 0.406: v80.03,28 81.4,28 84.65,31.25 R10.1 84.65,31.5 v81.65,34.5
  Bottom 0.406: v80.03,28 65.9,28 62.77,24.88 60.27,24.88 IC2.6 | v81.65,34.5 81.65,46.5 83.78,48.62 83.78,49.5 JP1.7
S_4  (via drill 0.61)
  Top 0.406: v56.4,23.5 57.27,23.5 60.52,20.25 75.53,20.25 84.4,29.12 84.65,29.12 R14.1
  Bottom 0.406: v56.4,23.5 54.15,23.5 IC2.10 | JP1.9 83.9,47 83.9,46.12 85.15,44.88 85.15,34.62 85.9,33.88 85.9,30.38 84.78,29.25 R14.1
S_5
  Bottom 0.406: 82.65,33.38 84.65,33.38 R18.1 | 82.65,33.38 60.4,33.38 57.9,30.88 57.9,28.5 55.52,26.12 54.15,26.12 IC2.12 | 82.65,33.38 82.65,42.5 83.78,43.62 83.78,44.5 JP1.11
SYNC-1
  Top 0.406: U$1.5 9.78,27.38 6.15,31 6.15,44.12 10.53,48.5 11.15,48.5 J1.5
SYNC-2  (via drill 0.61)
  Top 0.406: v17.52,42.75 17.52,46.38 19.65,48.5 20.02,48.5 J2.5
  Bottom 0.406: U$2.5 19.02,27.38 17.4,29 17.4,37.25 16.4,38.25 16.4,41.88 17.27,42.75 v17.52,42.75
SYNC-3  (via drill 0.61)
  Top 0.406: U$3.5 29.15,27.38 27.02,29.5 27.02,31.12 28.77,32.88 v28.77,34.38
  Bottom 0.406: v28.77,34.38 33.77,34.38 34.4,35 34.4,45.5 31.4,48.5 31.02,48.5 J3.5
SYNC-4  (via drill 0.61)
  Top 0.406: v66.4,27 66.4,33.38 66.78,33.75 66.78,36.38 v65.15,38
  Bottom 0.406: U$4.5 39.4,27.38 38.27,26.25 38.27,23.12 35.65,20.5 35.65,16.25 37.02,14.88 61.02,14.88 66.4,20.25 v66.4,27 | v65.15,38 55.4,47.75 55.4,56 53.9,57.5 49.65,57.5 40.77,48.62 40.4,48.62 J4.5
SYNC-5  (via drill 0.61)
  Top 0.406: U$5.5 51.65,27.38 v49.65,29.38 | v49.77,40.25 49.77,46.25 52.02,48.5 52.27,48.5 J5.5
  Bottom 0.406: v49.65,29.38 48.15,30.88 48.15,32.88 47.77,33.25 47.77,38.25 v49.77,40.25
SYNC-SEL  (via drill 0.61)
  Top 0.406: v32.77,26.12 40.15,26.12 U$3.15 40.27,26 44.27,26 50.27,20 59.9,20 60.65,19.25 v61.27,19.25 | v8.78,25.12 8.78,20.88 9.65,20 v13.9,20 | v17.9,25 18.9,26 19.77,26 U$1.15 20.02,26.12 v21.65,26.12 | 64.15,36.62 64.15,40.5 74.4,50.75 74.9,50.75 J6.4 | 64.15,36.62 64.15,27.75 62.52,26.12 61.77,26.12 U$5.15 | v65.4,24.75 65.4,33.25 66.15,34 66.15,34.75 64.28,36.62 64.15,36.62
  Bottom 0.406: v32.77,26.12 31.02,26.12 U$4.15 30.77,26.12 v21.65,26.12 | v8.78,25.12 9.65,26 10.53,26 U$2.15 | v13.9,20 13.9,20.5 17.9,24.5 v17.9,25 | v61.27,19.25 61.27,20.62 v65.4,24.75

### Text on the board
tPlace: OUTPUT | INPUT | R / G / B / S / AR / AL / 5V / GND | R_IN / G_IN / B_IN / S_IN / A_R / A_L / +5V / GND
bPlace: OUTPUT | INPUT | R / G / B / S / AR / AL / 5V / GND | R_IN / G_IN / B_IN / S_IN / A_R / A_L / +5V / GND